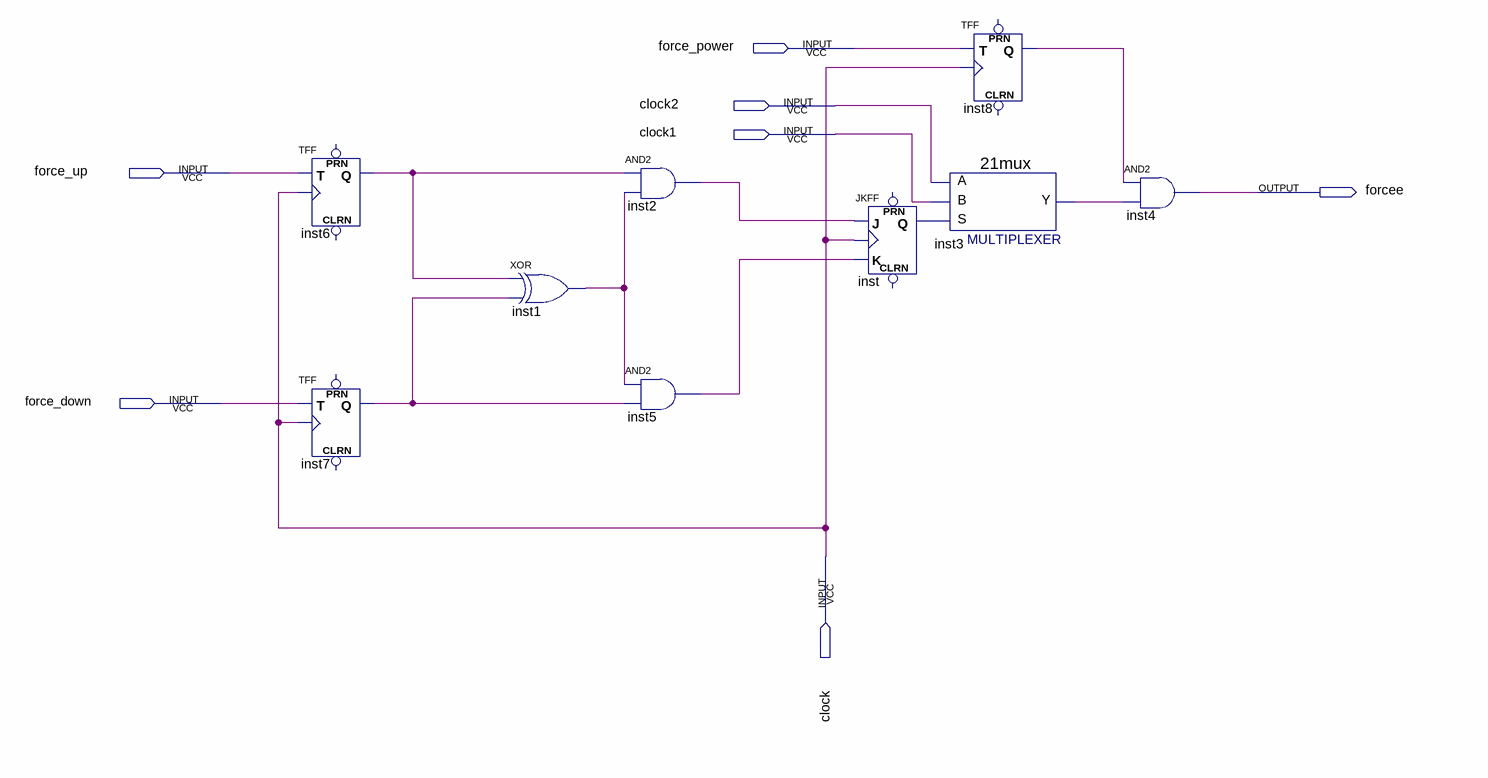
[diagram p0: schematic sheet]
// Quartus schematic masage.bdf as structural Verilog: 9 symbols, 7 pins
module masage (
  input  force_power,
  input  clock2,
  input  clock1,
  input  force_up,
  input  force_down,
  input  clock,
  output forcee
);

  wire inst1_out, inst2_out, inst3_y, inst5_out, inst6_q, inst7_q, inst8_q, inst_q;

  TFF inst6 (.T(force_up), .CLK(clock), .Q(inst6_q));  // open: PRN, CLRN
  TFF inst7 (.T(force_down), .CLK(clock), .Q(inst7_q));  // open: PRN, CLRN
  xor inst1 (inst1_out, inst6_q, inst7_q);
  and inst2 (inst2_out, inst6_q, inst1_out);
  and inst5 (inst5_out, inst1_out, inst7_q);
  JKFF inst (.K(inst5_out), .J(inst2_out), .CLK(clock), .Q(inst_q));  // open: PRN, CLRN
  TFF inst8 (.T(force_power), .CLK(clock), .Q(inst8_q));  // open: PRN, CLRN
  \21mux  inst3 (.S(inst_q), .B(clock1), .A(clock2), .Y(inst3_y));
  and inst4 (forcee, inst8_q, inst3_y);
endmodule
